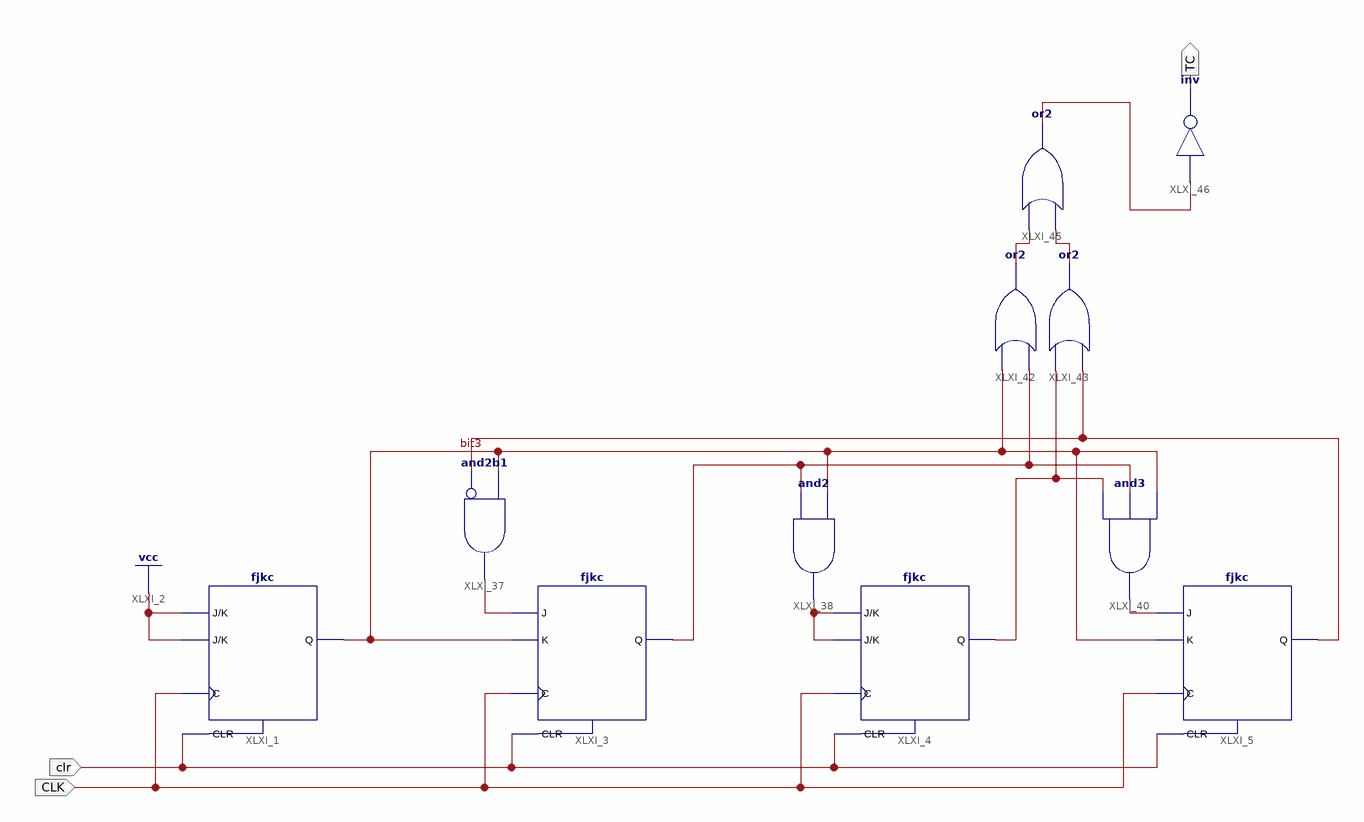
[diagram p0: schematic sheet 1]
// Xilinx ISE schematic mod10nn.sch (spartan6) as structural Verilog: 11 symbols, 3 ports
module mod10nn (
  input  CLK,
  input  clr,
  output TC
);

  wire bit0, bit1, bit2, bit3, XLXN_62, XLXN_63, XLXN_65, XLXN_68, XLXN_69, XLXN_72;

  fjkc XLXI_1 (.C(CLK), .CLR(clr), .J(1'b1), .K(1'b1), .Q(bit3));
  fjkc XLXI_3 (.C(CLK), .CLR(clr), .J(XLXN_62), .K(bit3), .Q(bit2));
  fjkc XLXI_4 (.C(CLK), .CLR(clr), .J(XLXN_63), .K(XLXN_63), .Q(bit1));
  fjkc XLXI_5 (.C(CLK), .CLR(clr), .J(XLXN_65), .K(bit3), .Q(bit0));
  and XLXI_37 (XLXN_62, ~bit0, bit3);  // and2b1
  and XLXI_38 (XLXN_63, bit2, bit3);
  and XLXI_40 (XLXN_65, bit1, bit2, bit3);
  or XLXI_42 (XLXN_68, bit2, bit3);
  or XLXI_43 (XLXN_69, bit0, bit1);
  or XLXI_45 (XLXN_72, XLXN_69, XLXN_68);
  not XLXI_46 (TC, XLXN_72);
endmodule
